# EAGLE board ME461_F28027 (EAGLE 7.7.0), part 1 of 2
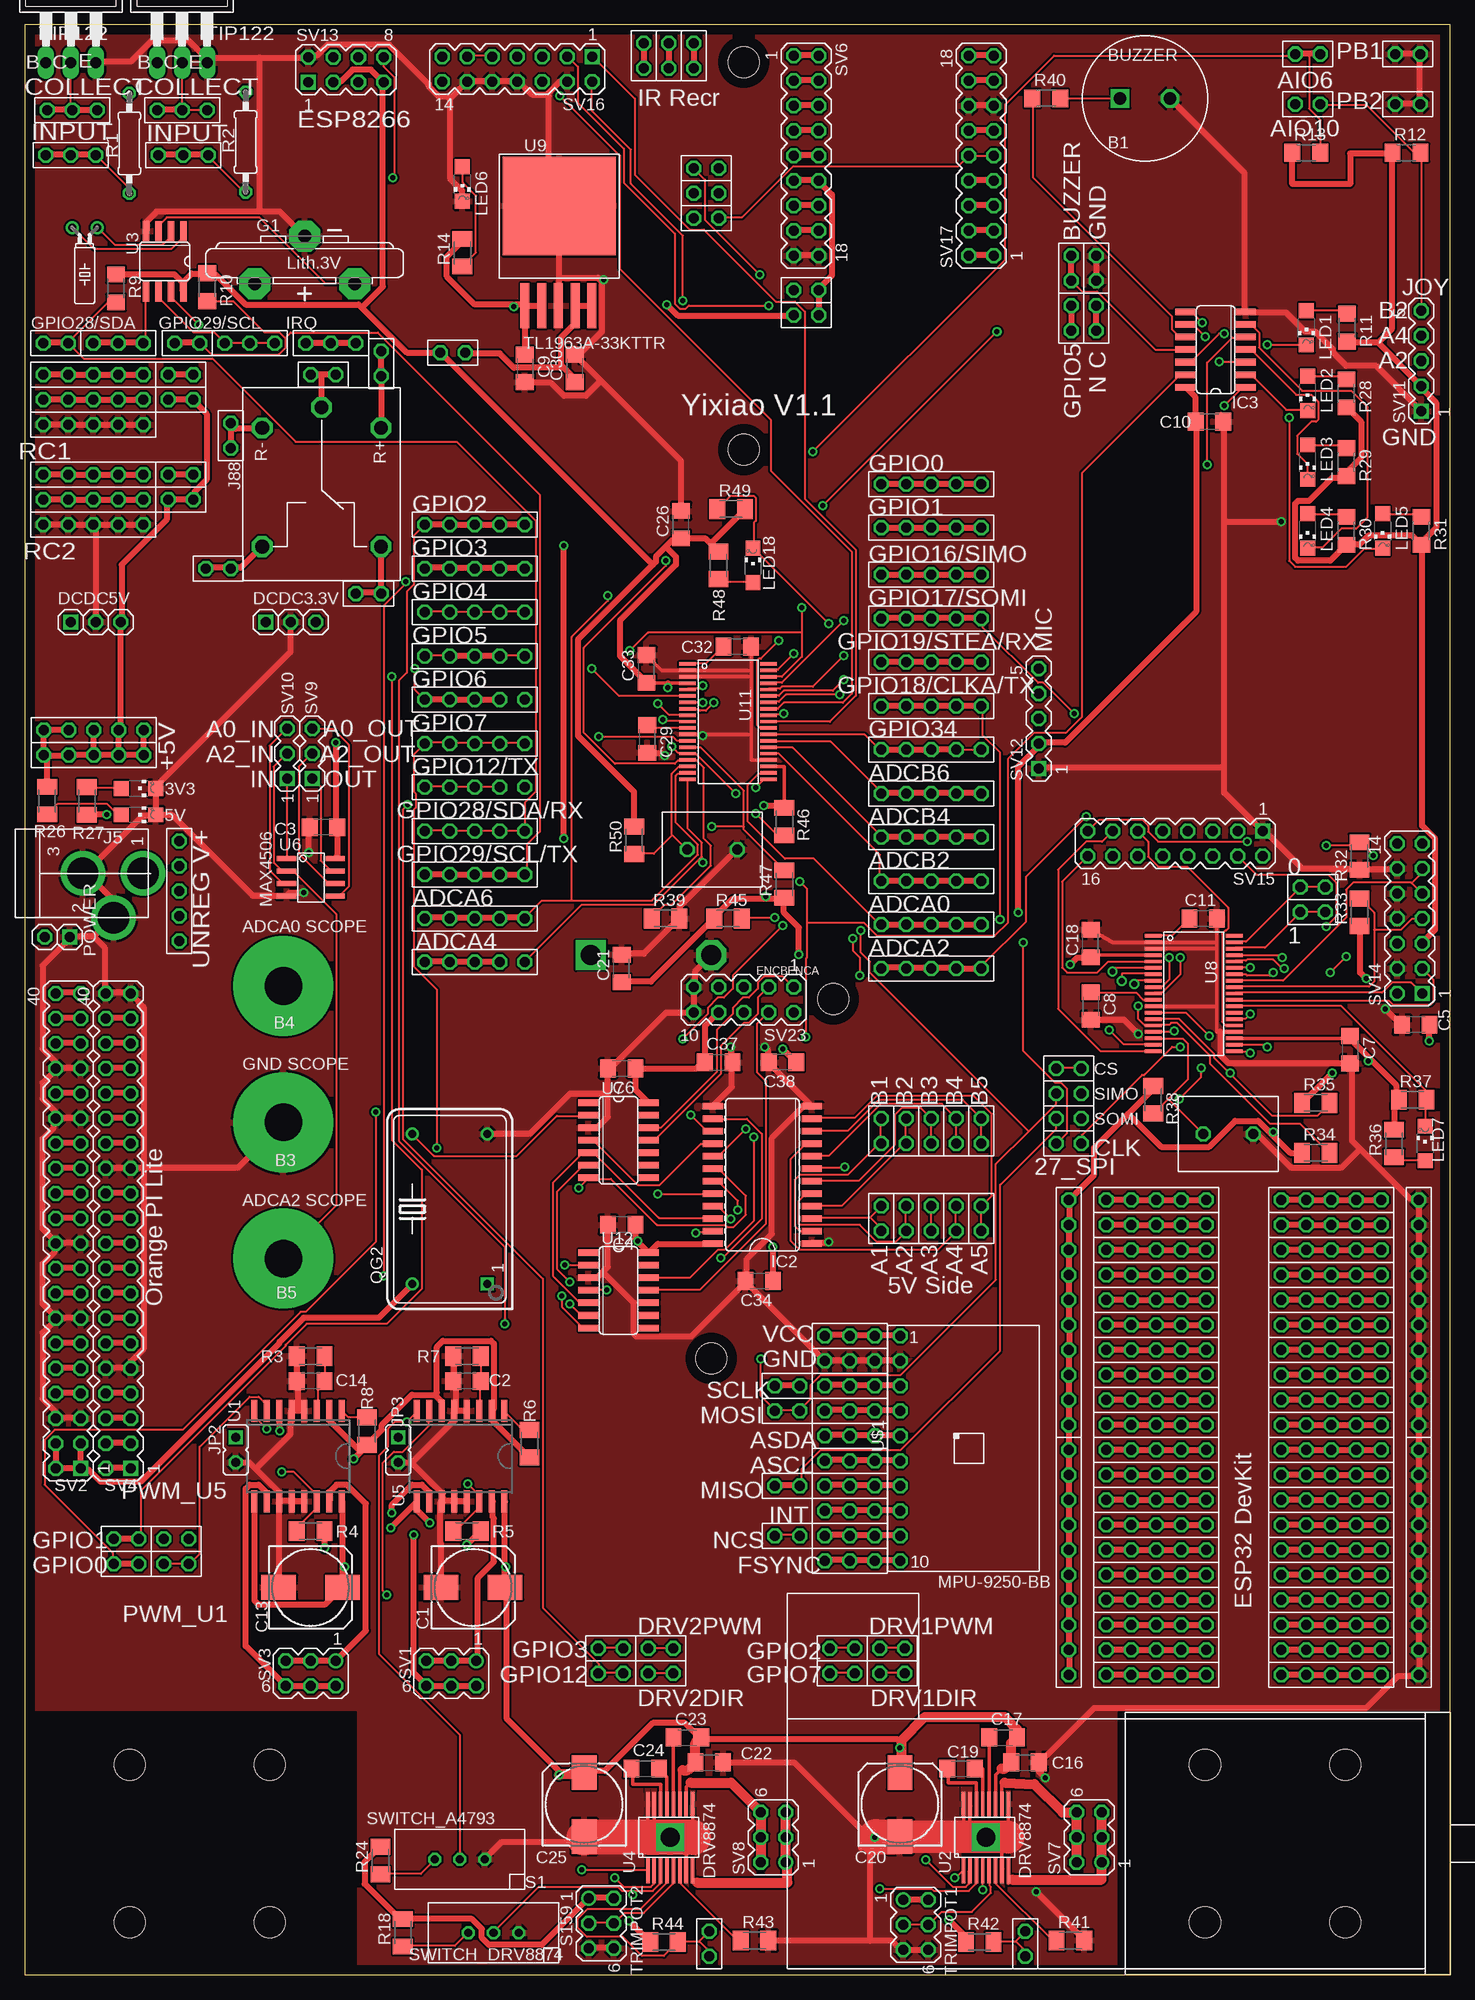
[diagram p5: board, top side]
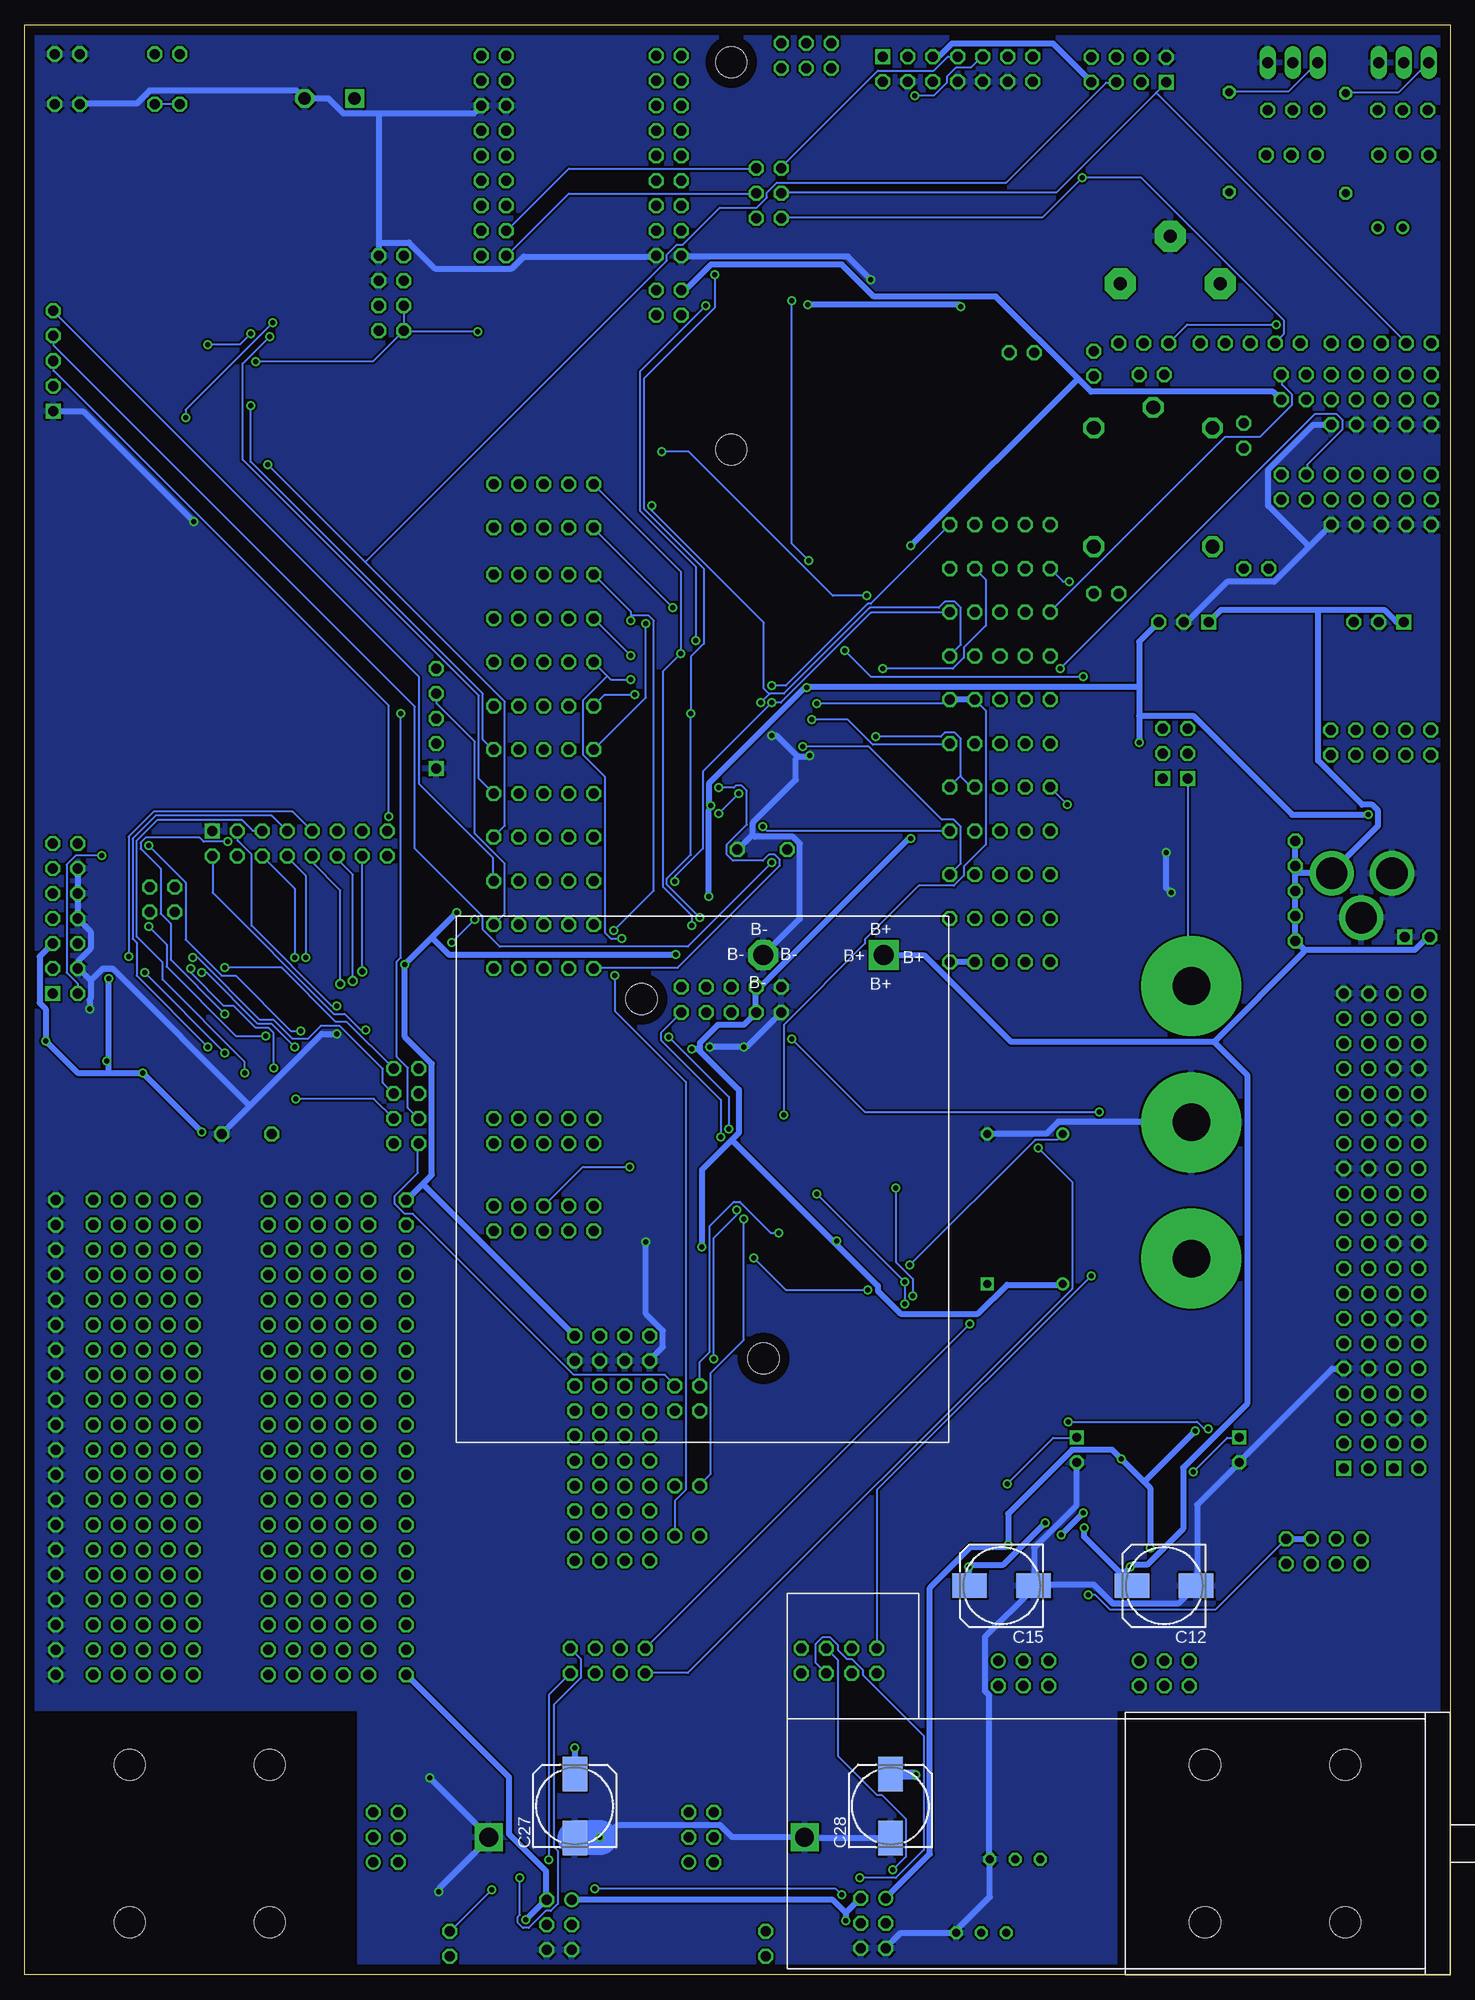
[diagram p6: board, bottom side, seen from below]

Size 144.78 x 198.12 mm. Coordinates in mm from the lower left corner, seen from the top.
Outline: 0,0 144.78,0 144.78,198.12 0,198.12 0,0
Copper layers (1*16): Top 0.035mm / dielectric 1.5mm / Bottom 0.035mm
Design rules "default *": minimum track width 8mil, minimum drill 20mil, track to track 8mil, track to pad 8mil, pad to pad 8mil, via to via 8mil, smd to smd 8mil, copper to edge 40mil, drill to drill 8mil, minimum pad ring 10mil, minimum via ring 8mil, stop-mask expansion 4mil, vias tented up to drill 20mil, thermal gap 10mil
Net classes: 0 default: width 0.203 mm, drill 0.508 mm, clearance 0.203 mm; 1 supply: width 0.61 mm, drill 0.508 mm, clearance 0.203 mm
tRestrict: area 0,0 to 33.7,26.7; area 111.1,0 to 144.8,26.7
bRestrict: area 111.1,0 to 144.8,26.7; area 0,0 to 33.7,26.7

## Footprints (pad centres in the part's own frame; a part is rotated, then mirrored left to right if it is on the bottom)
CHIPLED_1206 = smd 1.5 x 1.5: A 0,-1.75; C 0,1.75
BUZZER = drill 1.27 square: P$1 -2.54,0 | drill 1.27 octagon: P$2 2.54,0
BATTERY_4AA_HOLDER = drill 2.032 square: P$1 0,0 | drill 2.032 octagon: P$2 12.224,0 | hole 3.175: 12.224,40.958; 24.606,4.445
BANANA_MALE = drill 3.81 pad 10.16: P$1 0,0
153CLV-0810 = smd 3.5 x 2.5: + 3.25,0; - -3.25,0
C1206 = smd 1.6 x 1.8: 1 -1.4,0; 2 1.4,0
1X03 = drill 1.016 square: 1 -2.54,0 | drill 1.016 octagon: 2 0,0; 3 2.54,0
CR2032V = drill 1.321 pad 3.15 octagon: + -2.54,-5.08; +@1 -2.54,5.08; - 2.286,0
SO24W = smd 0.66 x 2.032: 1 -6.985,-5.029; 2 -5.715,-5.029; 3 -4.445,-5.029; 4 -3.175,-5.029; 5 -1.905,-5.029; 6 -0.635,-5.029; 7 0.635,-5.029; 8 1.905,-5.029; 9 3.175,-5.029; 10 4.445,-5.029; 11 5.715,-5.029; 12 6.985,-5.029; 13 6.985,5.029; 14 5.715,5.029; 15 4.445,5.029; 16 3.175,5.029; 17 1.905,5.029; 18 0.635,5.029; 19 -0.635,5.029; 20 -1.905,5.029; 21 -3.175,5.029; 22 -4.445,5.029; 23 -5.715,5.029; 24 -6.985,5.029
SO14 = smd 0.66 x 2.032: 1 -3.81,-3.073; 2 -2.54,-3.073; 3 -1.27,-3.073; 4 0,-3.073; 5 1.27,-3.073; 6 2.54,-3.073; 7 3.81,-3.073; 8 3.81,3.073; 9 2.54,3.073; 10 1.27,3.073; 11 0,3.073; 12 -1.27,3.073; 13 -2.54,3.073; 14 -3.81,3.073
STRIP3 = drill 1.016 octagon: P$1 0,0; P$2 2.54,0; P$3 5.08,0
JACK-PMS = drill 3.175 pad 4.5: 1 -0.5,-3.31; 2 -5,-0.31; 3 -0.5,2.809
STRIP2 = drill 1.016 octagon: P$1 0,0; P$2 2.54,0
RELAY_JQC-3F_5V = drill 1.397 octagon: P$1 0,0; P$2 2.064,6.032; P$3 14.129,6.032; P$4 14.129,-6.032; P$5 2.064,-6.032
JP1 = drill 0.914 square: 1 0,-1.27 | drill 0.914 octagon: 2 0,1.27
TH_PUSHBUTTON = drill 1.016 octagon: 1 0,2.54; 2 0,-2.54
1X02 = drill 1.016 square: 1 -1.27,0 | drill 1.016 octagon: 2 1.27,0
TC26H = drill 0.813: 1 -1.27,0; 2 1.27,0
DIL14S = drill 0.813 square: 1 -7.62,-3.81 | drill 0.813: 7 7.62,-3.81; 8 7.62,3.81; 14 -7.62,3.81
0207/10 = drill 0.813 octagon: 1 -5.08,0; 2 5.08,0
M1206 = smd 1.6 x 2: 1 -1.4,0; 2 1.4,0
R1206 = smd 1.6 x 1.803: 1 -1.422,0; 2 1.422,0
SWITCH_SLIDE = drill 0.813 octagon: P$1 0,-5.08; P$2 0,-2.54; P$3 0,0
STRIP5 = drill 1.016 octagon: P$1 0,0; P$2 2.54,0; P$3 5.08,0; P$4 7.62,0; P$5 10.16,0
STRIP10 = drill 1.016 octagon: P$1 0,0; P$2 2.54,0; P$3 5.08,0; P$4 7.62,0; P$5 10.16,0; P$6 12.7,0; P$7 15.24,0; P$8 17.78,0; P$9 20.32,0; P$10 22.86,0
MA03-2 = drill 1.016: 1 -2.54,-1.27 | drill 1.016 octagon: 2 -2.54,1.27; 3 0,-1.27; 4 0,1.27; 5 2.54,-1.27; 6 2.54,1.27
MA20-2 = drill 1.016 square: 1 -24.13,-1.27 | drill 1.016 octagon: 2 -24.13,1.27; 3 -21.59,-1.27; 4 -21.59,1.27; 5 -19.05,-1.27; 6 -19.05,1.27; 7 -16.51,-1.27; 8 -16.51,1.27; 9 -13.97,-1.27; 10 -13.97,1.27; 11 -11.43,-1.27; 12 -11.43,1.27; 13 -8.89,-1.27; 14 -8.89,1.27; 15 -6.35,-1.27; 16 -6.35,1.27; 17 -3.81,-1.27; 18 -3.81,1.27; 19 -1.27,-1.27; 20 -1.27,1.27; 21 1.27,-1.27; 22 1.27,1.27; 23 3.81,-1.27; 24 3.81,1.27; 25 6.35,-1.27; 26 6.35,1.27; 27 8.89,-1.27; 28 8.89,1.27; 29 11.43,-1.27; 30 11.43,1.27; 31 13.97,-1.27; 32 13.97,1.27; 33 16.51,-1.27; 34 16.51,1.27; 35 19.05,-1.27; 36 19.05,1.27; 37 21.59,-1.27; 38 21.59,1.27; 39 24.13,-1.27; 40 24.13,1.27
MA09-2 = drill 1.016 octagon: 1 -10.16,-1.27; 2 -10.16,1.27; 3 -7.62,-1.27; 4 -7.62,1.27; 5 -5.08,-1.27; 6 -5.08,1.27; 7 -2.54,-1.27; 8 -2.54,1.27; 9 0,-1.27; 10 0,1.27; 11 2.54,-1.27; 12 2.54,1.27; 13 5.08,-1.27; 14 5.08,1.27; 15 7.62,-1.27; 16 7.62,1.27; 17 10.16,-1.27; 18 10.16,1.27
MA03-1 = drill 1.016 square: 1 -2.54,0 | drill 1.016 octagon: 2 0,0; 3 2.54,0
MA05-1 = drill 1.016 square: 1 -5.08,0 | drill 1.016 octagon: 2 -2.54,0; 3 0,0; 4 2.54,0; 5 5.08,0
MA04-2 = drill 1.016 square: 1 -3.81,-1.27 | drill 1.016 octagon: 2 -3.81,1.27; 3 -1.27,-1.27; 4 -1.27,1.27; 5 1.27,-1.27; 6 1.27,1.27; 7 3.81,-1.27; 8 3.81,1.27
MA07-2 = drill 1.016 square: 1 -7.62,-1.27 | drill 1.016 octagon: 2 -7.62,1.27; 3 -5.08,-1.27; 4 -5.08,1.27; 5 -2.54,-1.27; 6 -2.54,1.27; 7 0,-1.27; 8 0,1.27; 9 2.54,-1.27; 10 2.54,1.27; 11 5.08,-1.27; 12 5.08,1.27; 13 7.62,-1.27; 14 7.62,1.27
MA08-2 = drill 1.016 square: 1 -8.89,-1.27 | drill 1.016 octagon: 2 -8.89,1.27; 3 -6.35,-1.27; 4 -6.35,1.27; 5 -3.81,-1.27; 6 -3.81,1.27; 7 -1.27,-1.27; 8 -1.27,1.27; 9 1.27,-1.27; 10 1.27,1.27; 11 3.81,-1.27; 12 3.81,1.27; 13 6.35,-1.27; 14 6.35,1.27; 15 8.89,-1.27; 16 8.89,1.27
MA05-2 = drill 1.016 octagon: 1 -5.08,-1.27; 2 -5.08,1.27; 3 -2.54,-1.27; 4 -2.54,1.27; 5 0,-1.27; 6 0,1.27; 7 2.54,-1.27; 8 2.54,1.27; 9 5.08,-1.27; 10 5.08,1.27
TO220 = drill 1.118 long: 1 -2.54,-6.35; 2 0,-6.35; 3 2.54,-6.35
SO16W = smd 0.6 x 2.2: 1 -4.445,-4.6; 2 -3.175,-4.6; 3 -1.905,-4.6; 4 -0.635,-4.6; 5 0.635,-4.6; 6 1.905,-4.6; 7 3.175,-4.6; 8 4.445,-4.6; 9 4.445,4.6; 10 3.175,4.6; 11 1.905,4.6; 12 0.635,4.6; 13 -0.635,4.6; 14 -1.905,4.6; 15 -3.175,4.6; 16 -4.445,4.6
HTSSOP16 = smd 2.5 x 0.35: P$1 -3.4,2.275; P$2 -3.4,1.625; P$3 -3.4,0.975; P$4 -3.4,0.325; P$5 -3.4,-0.325; P$6 -3.4,-0.975; P$7 -3.4,-1.625; P$8 -3.4,-2.275; P$9 3.4,-2.275; P$10 3.4,-1.625; P$11 3.4,-0.975; P$12 3.4,-0.325; P$13 3.4,0.325; P$14 3.4,0.975; P$15 3.4,1.625; P$16 3.4,2.275 | drill 1.905 pad 2.54 square: P$17 0,0
SO08 = smd 0.66 x 2.032: 1 -1.905,-3.073; 2 -0.635,-3.073; 3 0.635,-3.073; 4 1.905,-3.073; 5 1.905,3.073; 6 0.635,3.073; 7 -0.635,3.073; 8 -1.905,3.073
SOIC-8 = smd 1.98 x 0.53: P$1 -2.465,1.905; P$2 -2.465,0.635; P$3 -2.465,-0.635; P$4 -2.465,-1.905; P$5 2.465,-1.905; P$6 2.465,-0.635; P$7 2.465,0.635; P$8 2.465,1.905
DA38 = smd 0.35 x 1.705: 1 -5.85,-4.12; 2 -5.2,-4.12; 3 -4.55,-4.12; 4 -3.9,-4.12; 5 -3.25,-4.12; 6 -2.6,-4.12; 7 -1.95,-4.12; 8 -1.3,-4.12; 9 -0.65,-4.12; 10 0,-4.12; 11 0.65,-4.12; 12 1.3,-4.12; 13 1.95,-4.12; 14 2.6,-4.12; 15 3.25,-4.12; 16 3.9,-4.12; 17 4.55,-4.12; 18 5.2,-4.12; 19 5.85,-4.12; 20 5.85,4.12; 21 5.2,4.12; 22 4.55,4.12; 23 3.9,4.12; 24 3.25,4.12; 25 2.6,4.12; 26 1.95,4.12; 27 1.3,4.12; 28 0.65,4.12; 29 0,4.12; 30 -0.65,4.12; 31 -1.3,4.12; 32 -1.95,4.12; 33 -2.6,4.12; 34 -3.25,4.12; 35 -3.9,4.12; 36 -4.55,4.12; 37 -5.2,4.12; 38 -5.85,4.12
TL1963AKTTR = smd 0.914 x 4.572: P$1 -3.81,-10.16; P$2 -2.108,-10.16; P$3 -0.406,-10.16; P$4 1.295,-10.16; P$5 2.997,-10.16 | smd 11.5 x 10: P$6 -0.3,0
MPU-9250-BB = drill 1.016 octagon: 1 -11.434,-6.96; 2 -8.894,-6.96; 3 -6.354,-6.96; 4 -3.814,-6.96; 5 -1.274,-6.96; 6 1.266,-6.96; 7 3.806,-6.96; 8 6.346,-6.96; 9 8.886,-6.96; 10 11.426,-6.96
GEARMOTOR_MOUNT = hole 3.175: 7.112,8.001; -7.112,8.001; -7.112,-8.001; 7.112,-8.001
CASTERWHEEL = hole 3.175: 19.685,0; -19.685,0

## Placement (x,y rotation side)
3V3  [CHIPLED_1206]  11.56,120.52 270 top
5V  [CHIPLED_1206]  11.56,117.86 270 top
B1  BUZZER  [BUZZER]  113.79,190.63 0 top
B2  BATTERY_4AA_HOLDER  [BATTERY_4AA_HOLDER]  57.52,103.58 180 bottom
B3  GND SCOPE  [BANANA_MALE]  26.29,86.61 0 top
B4  ADCA0 SCOPE  [BANANA_MALE]  26.29,100.46 0 top
B5  ADCA2 SCOPE  [BANANA_MALE]  26.29,72.77 0 top
C1  47uF  [153CLV-0810]  45.56,39.36 0 top
C2  680pF  [C1206]  44.92,60.32 180 top
C3  0.1uf  [C1206]  30.35,116.59 180 top
C4  0.1uF  [C1206]  60.64,76.2 180 top
C5  0.1 uF  [C1206]  141.29,96.52 180 top
C6  0.1uF  [C1206]  60.64,92.08 180 top
C7  2.2 uF  [C1206]  134.62,93.98 270 top
C8  2.2 uF  [C1206]  108.27,98.42 270 top
C9  10 uF  [C1206]  50.8,163.19 270 top
C10  0.1uf  [C1206]  120.33,157.8 0 top
C11  2.2 uF  [C1206]  119.7,107.31 0 top
C12  47uF  [153CLV-0810]  29.05,39.53 180 bottom
C13  47uF  [153CLV-0810]  29.05,39.36 0 top
C14  680pF  [C1206]  29.05,60.32 180 top
C15  47uF  [153CLV-0810]  45.56,39.53 180 bottom
C16  0.1uF  [C1206]  101.6,21.59 0 top
C17  0.1uF  [C1206]  99.38,24.13 0 top
C18  2.2 uF  [C1206]  108.27,104.78 90 top
C19  22nF  [C1206]  95.09,20.95 0 top
C20  47uF  [153CLV-0810]  88.9,17.3 90 top
C21  0.1 uF  [C1206]  60.64,102.23 90 top
C22  0.1uF  [C1206]  69.53,21.59 0 top
C23  0.1uF  [C1206]  67.31,24.13 0 top
C24  22nF  [C1206]  63.02,20.95 0 top
C25  47uF  [153CLV-0810]  56.83,17.3 90 top
C26  2.2 uF  [C1206]  66.67,147.32 90 top
C27  47uF  [153CLV-0810]  88.9,17.14 90 bottom
C28  47uF  [153CLV-0810]  56.83,17.14 90 bottom
C29  2.2 uF  [C1206]  63.23,125.55 270 top
C30  10 uF  [C1206]  55.88,163.19 90 top
C32  2.2 uF  [C1206]  72.38,134.94 0 top
C33  2.2 uF  [C1206]  63.16,132.66 90 top
C34  0.1uF  [C1206]  74.61,70.48 180 top
C37  0.1uF  [C1206]  70.48,92.71 0 top
C38  0.1uF  [C1206]  76.96,92.71 180 top
DCDC3.3V  [1X03]  27.05,137.41 0 top
DCDC5V  [1X03]  7.24,137.41 0 top
G1  CR2032V  [CR2032V]  28.44,174.33 90 top
IC2  743384DW  [SO24W]  74.93,81.28 90 top
IC3  7404D  [SO14]  120.97,165.1 90 top
J1  STRIP3  [STRIP3]  28.57,165.74 0 top
J2  STRIP3  [STRIP3]  20.32,165.74 0 top
J3  STRIP3  [STRIP3]  6.99,165.74 0 top
J4  STRIP3  [STRIP3]  2.28,189.45 0 top
J5  [JACK-PMS]  8.72,112.4 90 top
J6  STRIP3  [STRIP3]  2.15,184.87 0 top
J7  STRIP2  [STRIP2]  108.84,172.09 90 top
J8  STRIP2  [STRIP2]  108.84,167 90 top
J9  STRIP2  [STRIP2]  97.16,87 270 top
J10  STRIP2  [STRIP2]  94.61,87 270 top
J11  STRIP2  [STRIP2]  92.08,87 270 top
J12  STRIP2  [STRIP2]  62.87,193.68 90 top
J13  STRIP2  [STRIP2]  65.41,193.68 90 top
J14  STRIP2  [STRIP2]  89.53,87 270 top
J15  STRIP2  [STRIP2]  87,87 270 top
J16  STRIP2  [STRIP2]  97.16,78.11 270 top
J17  STRIP2  [STRIP2]  94.61,78.11 270 top
J18  STRIP2  [STRIP2]  92.08,78.11 270 top
J19  STRIP2  [STRIP2]  89.53,78.11 270 top
J20  STRIP2  [STRIP2]  87,78.11 270 top
J21  STRIP2  [STRIP2]  129.54,110.49 0 top
J22  STRIP2  [STRIP2]  67.94,193.68 90 top
J23  STRIP3  [STRIP3]  13.46,189.45 0 top
J24  STRIP3  [STRIP3]  13.58,184.87 0 top
J25  STRIP2  [STRIP2]  129.54,107.95 0 top
J26  STRIP2  [STRIP2]  106.3,167 90 top
J27  STRIP2  [STRIP2]  42.23,164.78 0 top
J28  STRIP2  [STRIP2]  80.64,168.59 180 top
J29  STRIP2  [STRIP2]  78.11,171.13 0 top
J30  STRIP2  [STRIP2]  70.48,183.51 180 top
J31  STRIP2  [STRIP2]  67.94,178.44 0 top
J32  STRIP2  [STRIP2]  67.94,180.97 0 top
J35  STRIP2  [STRIP2]  107.31,87 180 top
J36  STRIP2  [STRIP2]  107.31,89.53 180 top
J37  STRIP2  [STRIP2]  107.31,92.08 180 top
J38  STRIP2  [STRIP2]  107.31,84.45 180 top
J70  STRIP2  [STRIP2]  141.73,195.14 180 top
J71  STRIP2  [STRIP2]  131.57,195.14 180 top
J72  STRIP2  [STRIP2]  141.73,190.06 180 top
J73  STRIP2  [STRIP2]  131.57,190.06 180 top
J78  STRIP2  [STRIP2]  101.6,4.45 270 top
J79  STRIP2  [STRIP2]  86.84,33.18 0 top
J80  STRIP2  [STRIP2]  86.84,30.64 0 top
J81  STRIP2  [STRIP2]  69.53,4.45 270 top
J82  STRIP2  [STRIP2]  63.34,33.18 0 top
J83  STRIP2  [STRIP2]  63.34,30.64 0 top
J84  STRIP2  [STRIP2]  81.76,33.18 0 top
J85  STRIP2  [STRIP2]  81.76,30.64 0 top
J86  STRIP2  [STRIP2]  58.26,33.18 0 top
J87  STRIP2  [STRIP2]  58.26,30.64 0 top
J88  RELAY_JQC-3F_5V  [RELAY_JQC-3F_5V]  30.16,159.23 270 top
J89  STRIP2  [STRIP2]  36.2,164.94 270 top
J90  STRIP2  [STRIP2]  20.95,157.64 270 top
J91  STRIP2  [STRIP2]  29.05,162.56 0 top
J92  STRIP2  [STRIP2]  33.66,140.34 0 top
J93  STRIP2  [STRIP2]  18.41,142.88 0 top
J123  STRIP3  [STRIP3]  81.28,64.93 0 top
J124  STRIP3  [STRIP3]  81.28,62.39 0 top
J125  STRIP3  [STRIP3]  81.28,59.85 0 top
J126  STRIP3  [STRIP3]  81.28,57.31 0 top
J127  STRIP3  [STRIP3]  81.28,54.77 0 top
J128  STRIP3  [STRIP3]  81.28,52.23 0 top
J129  STRIP3  [STRIP3]  81.28,49.69 0 top
J130  STRIP3  [STRIP3]  81.28,47.15 0 top
J131  STRIP3  [STRIP3]  81.28,44.61 0 top
J132  STRIP3  [STRIP3]  81.28,42.07 0 top
J194  STRIP2  [STRIP2]  106.3,172.09 90 top
J196  STRIP2  [STRIP2]  14.13,41.75 0 top
J197  STRIP2  [STRIP2]  14.13,44.29 0 top
J198  STRIP2  [STRIP2]  9.05,41.75 0 top
J199  STRIP2  [STRIP2]  9.05,44.29 0 top
J200  STRIP2  [STRIP2]  14.61,160.02 0 top
J201  STRIP2  [STRIP2]  14.61,162.56 0 top
J202  STRIP2  [STRIP2]  14.61,152.4 0 top
J203  STRIP2  [STRIP2]  14.61,149.86 0 top
J204  STRIP2  [STRIP2]  76.2,57.31 0 top
J205  STRIP2  [STRIP2]  76.2,49.69 0 top
J206  STRIP2  [STRIP2]  76.2,59.85 0 top
J207  STRIP2  [STRIP2]  76.2,44.61 0 top
J208  STRIP2  [STRIP2]  1.91,165.74 0 top
J209  STRIP2  [STRIP2]  15.24,165.74 0 top
JP2  [JP1]  21.43,53.33 180 top
JP3  [JP1]  37.94,53.33 180 top
LED1  [CHIPLED_1206]  130.18,167.32 180 top
LED2  [CHIPLED_1206]  130.3,160.66 180 top
LED3  [CHIPLED_1206]  130.3,153.67 180 top
LED4  [CHIPLED_1206]  130.3,146.69 180 top
LED5  [CHIPLED_1206]  137.92,146.69 180 top
LED6  [CHIPLED_1206]  44.45,181.93 180 top
LED7  [CHIPLED_1206]  142.24,84.45 0 top
LED18  [CHIPLED_1206]  73.98,143.19 0 top
P1  [TH_PUSHBUTTON]  122.24,85.41 90 top
P2  [TH_PUSHBUTTON]  69.85,114.3 90 top
POWER  [1X02]  3.33,105.42 180 top
Q1  32.768KHz  [TC26H]  6.09,177.51 180 top
QG2  [DIL14S]  43.18,77.79 90 top
R1  R_B  [0207/10]  10.63,186.06 90 top
R2  R_B  [0207/10]  22.44,186.19 90 top
R3  24.9K  [M1206]  29.05,62.86 0 top
R4  2.2K  [M1206]  29.05,45.08 0 top
R5  2.2K  [M1206]  44.92,45.08 0 top
R6  2.2K  [M1206]  51.27,53.97 270 top
R7  24.9K  [M1206]  44.92,62.86 0 top
R8  2.2K  [M1206]  34.76,55.24 270 top
R9  4.7K  [R1206]  9.27,171.32 270 top
R10  4.7K  [R1206]  18.54,171.45 270 top
R11  [R1206]  134.3,167.32 270 top
R12  10k  [R1206]  140.34,185.1 0 top
R13  10k  [R1206]  130.18,185.1 0 top
R14  1K  [M1206]  44.45,174.94 90 top
R18  2.2K  [M1206]  38.41,4.28 90 top
R24  2.2K  [M1206]  36.13,11.62 90 top
R26  1K  [M1206]  2.29,119.29 90 top
R27  1K  [M1206]  6.31,119.26 270 top
R28  [R1206]  134.24,160.66 270 top
R29  [R1206]  134.24,153.67 270 top
R30  [R1206]  134.24,146.69 270 top
R31  [R1206]  141.86,146.69 270 top
R32  4.7K  [M1206]  135.57,113.67 270 top
R33  4.7K  [M1206]  135.57,107.95 90 top
R34  4.7k  [M1206]  131.13,83.5 0 top
R35  4.7k  [M1206]  131.13,88.58 0 top
R36  1K  [M1206]  139.06,84.45 90 top
R37  4.7k  [M1206]  140.97,88.9 180 top
R38  4.7k  [M1206]  114.62,88.9 90 top
R39  4.7K  [M1206]  65.09,107.31 0 top
R40  100  [R1206]  103.76,190.63 0 top
R41  1.8K  [M1206]  106.2,3.49 0 top
R42  10K  [M1206]  97,3.33 0 top
R43  1.8K  [M1206]  74.14,3.49 0 top
R44  10K  [M1206]  64.93,3.33 0 top
R45  4.7K  [M1206]  71.44,107.31 0 top
R46  4.7k  [M1206]  77.15,117.16 270 top
R47  4.7k  [M1206]  77.15,110.81 90 top
R48  1K  [M1206]  70.48,143.19 90 top
R49  4.7k  [M1206]  71.75,148.91 0 top
R50  4.7k  [M1206]  61.91,115.25 90 top
S1  SWITCH_A4793  [SWITCH_SLIDE]  41.66,11.75 90 top
S2  STRIP5  [STRIP5]  40.64,147.32 0 top
S3  STRIP5  [STRIP5]  40.64,142.88 0 top
S4  STRIP5  [STRIP5]  40.64,138.43 0 top
S5  STRIP5  [STRIP5]  40.64,133.99 0 top
S6  STRIP5  [STRIP5]  40.64,129.54 0 top
S7  STRIP5  [STRIP5]  40.64,125.09 0 top
S8  STRIP5  [STRIP5]  40.64,120.65 0 top
S9  STRIP5  [STRIP5]  40.64,116.2 0 top
S10  STRIP5  [STRIP5]  40.64,111.76 0 top
S11  STRIP5  [STRIP5]  40.64,107.31 0 top
S12  STRIP5  [STRIP5]  40.64,102.87 0 top
S13  STRIP5  [STRIP5]  87,151.45 0 top
S14  STRIP5  [STRIP5]  87,147 0 top
S15  STRIP5  [STRIP5]  87,142.24 0 top
S16  STRIP5  [STRIP5]  87,137.79 0 top
S17  STRIP5  [STRIP5]  12.12,123.91 180 top
S18  STRIP5  [STRIP5]  12.12,126.45 180 top
S19  STRIP5  [STRIP5]  87,133.35 0 top
S20  STRIP10  [STRIP10]  141.6,30.48 90 top
S21  STRIP5  [STRIP5]  87,128.91 0 top
S22  STRIP5  [STRIP5]  87,120.02 0 top
S23  STRIP5  [STRIP5]  87,106.68 0 top
S24  STRIP10  [STRIP10]  141.6,55.88 90 top
S25  STRIP5  [STRIP5]  87,115.57 0 top
S26  STRIP5  [STRIP5]  87,124.46 0 top
S27  STRIP5  [STRIP5]  87,111.12 0 top
S28  STRIP5  [STRIP5]  87,102.23 0 top
S53  STRIP10  [STRIP10]  106.05,30.48 90 top
S58  STRIP10  [STRIP10]  106.05,55.88 90 top
S129  STRIP5  [STRIP5]  12.06,157.48 180 top
S130  STRIP5  [STRIP5]  12.06,162.56 180 top
S137  STRIP5  [STRIP5]  12.06,147.32 180 top
S138  STRIP5  [STRIP5]  12.06,152.4 180 top
S139  STRIP5  [STRIP5]  12.06,149.86 180 top
S141  STRIP5  [STRIP5]  15.71,105.03 90 top
S147  STRIP5  [STRIP5]  12.06,160.02 180 top
S159  SWITCH_DRV8874  [SWITCH_SLIDE]  45.08,4.28 90 top
S167  STRIP5  [STRIP5]  109.86,78.74 0 top
S168  STRIP5  [STRIP5]  109.86,76.2 0 top
S169  STRIP5  [STRIP5]  109.86,73.66 0 top
S170  STRIP5  [STRIP5]  109.86,71.12 0 top
S171  STRIP5  [STRIP5]  109.86,68.58 0 top
S172  STRIP5  [STRIP5]  109.86,66.04 0 top
S173  STRIP5  [STRIP5]  109.86,63.5 0 top
S174  STRIP5  [STRIP5]  109.86,60.96 0 top
S175  STRIP5  [STRIP5]  109.86,58.42 0 top
S176  STRIP5  [STRIP5]  109.86,55.88 0 top
S177  STRIP5  [STRIP5]  109.86,53.34 0 top
S178  STRIP5  [STRIP5]  109.86,50.8 0 top
S179  STRIP5  [STRIP5]  109.86,48.26 0 top
S180  STRIP5  [STRIP5]  109.86,45.72 0 top
S181  STRIP5  [STRIP5]  109.86,43.18 0 top
S182  STRIP5  [STRIP5]  109.86,40.64 0 top
S183  STRIP5  [STRIP5]  109.86,38.1 0 top
S184  STRIP5  [STRIP5]  109.86,35.56 0 top
S185  STRIP5  [STRIP5]  109.86,33.02 0 top
S186  STRIP5  [STRIP5]  109.86,30.48 0 top
S187  STRIP5  [STRIP5]  127.64,30.48 0 top
S188  STRIP5  [STRIP5]  127.64,35.56 0 top
S189  STRIP5  [STRIP5]  127.64,33.02 0 top
S210  STRIP5  [STRIP5]  127.64,78.74 0 top
S211  STRIP5  [STRIP5]  127.64,76.2 0 top
S212  STRIP5  [STRIP5]  127.64,73.66 0 top
S213  STRIP5  [STRIP5]  127.64,71.12 0 top
S214  STRIP5  [STRIP5]  127.64,68.58 0 top
S215  STRIP5  [STRIP5]  127.64,66.04 0 top
S216  STRIP5  [STRIP5]  127.64,63.5 0 top
S217  STRIP5  [STRIP5]  127.64,60.96 0 top
S218  STRIP5  [STRIP5]  127.64,58.42 0 top
S219  STRIP5  [STRIP5]  127.64,55.88 0 top
S220  STRIP5  [STRIP5]  127.64,53.34 0 top
S221  STRIP5  [STRIP5]  127.64,50.8 0 top
S222  STRIP5  [STRIP5]  127.64,48.26 0 top
S223  STRIP5  [STRIP5]  127.64,45.72 0 top
S224  STRIP5  [STRIP5]  127.64,43.18 0 top
S225  STRIP5  [STRIP5]  127.64,40.64 0 top
S226  STRIP5  [STRIP5]  127.64,38.1 0 top
SV1  [MA03-2]  43.33,30.63 180 top
SV2  [MA20-2]  4.45,75.56 90 top
SV3  [MA03-2]  29.05,30.63 180 top
SV4  [MA20-2]  9.53,75.56 90 top
SV6  [MA09-2]  79.38,184.78 270 top
SV7  [MA03-2]  108.11,13.97 90 top
SV8  [MA03-2]  76.04,13.97 90 top
SV9  [MA03-1]  29.21,124.08 90 top
SV10  [MA03-1]  26.67,124.08 90 top
SV11  [MA05-1]  141.86,163.96 90 top
SV12  [MA05-1]  103,127.64 90 top
SV13  [MA04-2]  32.64,193.55 0 top
SV14  [MA07-2]  140.65,107.31 90 top
SV15  [MA08-2]  116.84,114.94 180 top
SV16  [MA07-2]  50.01,193.61 180 top
SV17  [MA09-2]  97.16,184.78 90 top
SV23  [MA05-2]  73.03,99.06 180 top
T1  TIP125  [TO220]  4.69,200.62 0 top
T2  TIP125  [TO220]  16,200.62 0 top
TRIMPOT1  [MA03-2]  90.49,5.08 270 top
TRIMPOT2  [MA03-2]  58.58,5.24 270 top
U1  A4973  [SO16W]  27.78,52.7 180 top
U2  DRV8874  [HTSSOP16]  97.63,13.97 90 top
U3  BQ32000  [SO08]  14.22,174.08 180 top
U4  DRV8874  [HTSSOP16]  65.56,13.97 90 top
U5  A4973  [SO16W]  44.29,52.7 180 top
U6  MAX4506  [SOIC-8]  29.08,111.51 0 top
U7  LS7366  [SO14]  60.33,84.77 270 top
U8  F28027  [DA38]  118.75,99.69 270 top
U9  TL1963A-33KTTR  [TL1963AKTTR]  54.61,179.71 0 top
U11  F28027  [DA38]  71.44,127.32 270 top
U12  LS7366  [SO14]  60.33,69.53 270 top
U$1  MPU-9250-BB  [MPU-9250-BB]  95.89,53.5 270 top
U$2  GEARMOTOR_MOUNT  [GEARMOTOR_MOUNT]  127,13.34 0 top
U$3  GEARMOTOR_MOUNT  [GEARMOTOR_MOUNT]  17.78,13.34 0 bottom
U$4  CASTERWHEEL  [CASTERWHEEL]  73.03,174.62 90 top

## Tracks (layer width: path | path; a pad name or v marks a point on that pad's centre or on a via)
5V_FTDI
  Top 0.203: 78.16,182.3 SV6.11 | 80.59,182.3 SV6.12
  Top 0.61: 80.59,182.3 78.16,182.3 | J28.P$1 80.67,168.66 80.67,171.09 J29.P$2 80.77,171.4 81.99,172.62 81.99,180.85 80.77,182.07 SV6.12
28027_1_GPIO0
  Top 0.203: U8.37 122.94,104.95 124.05,104.95 129.54,110.44 J21.P$1 129.54,110.54 132.08,110.54 J21.P$2
28027_1_GPIO1
  Top 0.203: U8.36 122.94,104.34 125.98,104.34 129.54,107.9 J25.P$1 129.54,108 132.08,108 J25.P$2
28027_1_GPIO2
  Top 0.203: U8.5 114.61,102.92 110.03,102.92 108.92,101.8 105.87,101.8 105.36,102.31 105.36,111.05 107.9,113.59 SV15.16
28027_1_GPIO3  (via drill 0.6)
  Top 0.203: U8.6 110.49,102.3 v110.49,101.92
  Bottom 0.203: v110.49,101.92 SV15.14
28027_1_GPIO4  (via drill 0.6)
  Top 0.203: U8.7 114.61,101.7 111.44,101.7 v111.44,100.97
  Bottom 0.203: v111.44,100.97 111.44,111.76 113.03,113.35 SV15.12
28027_1_GPIO5  (via drill 0.6)
  Top 0.203: U8.8 112.71,101 v112.71,100.65
  Bottom 0.203: v112.71,100.65 112.71,110.17 115.57,113.03 SV15.10
28027_1_GPIO6  (via drill 0.51)
  Top 0.203: v116.23,103.33 116.23,101.09 115.52,100.38 114.71,100.38 U8.9
  Bottom 0.203: 118.06,113.59 SV15.8 118.06,113.49 116.23,111.66 v116.23,103.33
28027_1_GPIO7  (via drill 0.51)
  Top 0.203: v117.35,103.33 117.35,101.6 115.52,99.77 114.71,99.77 U8.10
  Bottom 0.203: v117.35,103.33 117.35,110.34 120.6,113.59 SV15.6
28027_1_GPIO12  (via drill 0.51)
  Top 0.203: v120.29,95.4 117.96,97.74 114.71,97.74 U8.13 | v132.18,106.48 133.2,107.49 133.2,110.95 132.38,111.76 125.07,111.76 123.24,113.59 SV15.4
  Bottom 0.203: v120.29,95.4 123.34,95.4 130.35,102.41 130.35,104.65 v132.18,106.48
28027_1_GPIO34
  Top 0.203: LED7.C 142.24,88.8 142.34,88.9 R37.1 142.24,88.9 142.24,89.92 133.71,98.45 122.94,98.45 U8.27
28027_1_SCL  (via drill 0.51)
  Top 0.203: R34.2 132.49,83.52 129.54,86.46 126.49,86.46 120.4,92.56 120.4,93.37 117.04,96.72 116.43,96.72 116.23,96.52 114.71,96.52 U8.15 114.61,96.52 113.69,96.52 113.08,97.13 v113.08,98.45
  Bottom 0.203: v113.08,98.45 113.59,98.45 121.72,106.58 121.72,113.79 123.14,115.21 123.14,116.13 SV15.3
28027_1_SDA  (via drill 0.51)
  Top 0.203: 122.38,91.59 126.69,87.27 131.27,87.27 132.49,88.49 R35.2 | 122.38,91.59 120.8,93.17 120.8,93.57 117.25,97.13 114.71,97.13 U8.14 | v122.43,91.64 122.38,91.59
  Bottom 0.203: v122.43,91.64 122.43,92.76 130.76,101.09 130.76,102.82 133.4,105.46 133.4,115.21 131.27,117.35 122.73,117.35 121.61,116.23 120.7,116.23 SV15.5
28027_1_SPICLKA  (via drill 0.51)
  Top 0.203: v126.8,101.8 126.49,101.5 124.16,101.5 124.05,101.6 122.94,101.6 U8.32 | v117.35,94.28 116.53,94.28 113.69,91.44 113.49,91.44 107.39,85.34 107.39,84.53 J38.P$1
  Bottom 0.203: v126.8,101.8 126.29,101.8 121.11,96.62 119.69,96.62 v117.35,94.28
28027_1_SPISIMOA  (via drill 0.51)
  Top 0.203: v127.71,103.33 127.51,103.53 122.94,103.53 U8.35
  Bottom 0.203: v127.71,103.33 127.2,103.33 120.9,97.03 119.48,97.03 117.55,95.1 116.03,95.1 114.71,96.42 112.78,96.42 108.41,92.05 108.41,90.63 J36.P$1
28027_1_SPISOMIA  (via drill 0.51)
  Top 0.203: v127.91,102.21 127.71,102.21 126.8,103.12 124.16,103.12 124.05,103.02 122.94,103.02 U8.34 | v119.48,92.15 119.48,91.24 v117.25,89
  Bottom 0.203: v127.91,102.21 127.91,101.8 124.56,98.45 123.55,98.45 121.31,96.22 119.99,96.22 119.48,95.71 v119.48,92.15 | v117.25,89 109.32,89 J35.P$1
28027_1_SPISTEA  (via drill 0.51)
  Top 0.203: v124.46,102.31 122.94,102.31 U8.33 | J37.P$2 104.85,92.15 107.29,92.15 J37.P$1
  Bottom 0.203: v124.46,102.31 118.67,102.31 113.18,96.83 112.06,96.83 J37.P$1
28027_2_GPIO0  (via drill 0.51)
  Top 0.203: 9.14,41.76 J198.P$1 8.94,41.96 8.94,42.88 2.03,49.78 2.03,54.36 3.05,55.37 16.05,55.37 28.04,67.36 28.55,67.36 35.66,74.47 v35.66,87.68 | J198.P$2 | 89.51,151.49 S13.P$2 89.61,151.49 | 87.07,151.49 S13.P$1 | 92.05,151.49 S13.P$3 92.15,151.49 | 94.59,151.49 S13.P$4 94.69,151.49 | 97.13,151.49 S13.P$5 | v78.13,134.21 76.5,132.59 75.59,132.59 U11.37 | v66.85,95.1 69.39,97.64 69.39,98.25 70.41,99.26 71.02,99.26 71.93,100.18 71.93,101.5 v77.01,106.58
  Top 0.61: J198.P$2 9.14,41.76 | 87.07,151.49 89.51,151.49 | 89.61,151.49 92.05,151.49 | 92.15,151.49 94.59,151.49 | 94.69,151.49 97.13,151.49
  Bottom 0.203: S13.P$1 86.97,151.38 78.13,142.54 v78.13,134.21 79.96,132.38 79.96,110.54 77.01,107.59 v77.01,106.58 | v35.66,87.68 59.44,87.68 v66.85,95.1
28027_2_GPIO1  (via drill 0.51)
  Top 0.203: 9.14,44.3 J199.P$1 | J199.P$2 11.79,44.5 11.79,49.17 26.52,63.91 26.52,64.01 28.65,66.14 36.78,66.14 40.34,69.7 40.34,81.79 37.29,84.84 v37.29,131.88 | 89.51,147.01 S14.P$2 89.61,147.01 | 87.07,147.01 S14.P$1 | 92.05,147.01 S14.P$3 92.15,147.01 | 94.59,147.01 S14.P$4 94.69,147.01 | 97.13,147.01 S14.P$5 | v78.94,138.89 78.94,136.35 | 78.94,136.35 78.94,133.91 76.91,131.88 75.59,131.88 U11.36 | v61.47,134.52 63.3,136.35 78.94,136.35
  Top 0.61: J199.P$2 9.14,44.3 | 87.07,147.01 89.51,147.01 | 89.61,147.01 92.05,147.01 | 92.15,147.01 94.59,147.01 | 94.69,147.01 97.13,147.01
  Bottom 0.203: v78.94,138.89 86.97,146.91 S14.P$1 | v37.29,131.88 58.83,131.88 v61.47,134.52
28027_2_GPIO2  (via drill 0.51)
  Top 0.203: J84.P$1 81.79,33.22 84.23,33.22 J84.P$2 | v68.89,130.96 68.58,130.66 67.36,130.66 U11.5 | v48.77,66.14 48.77,73.97 38,84.73 38,131.47 38.81,132.28 38.81,140.51 39.52,141.22 39.52,146.2 S2.P$1
  Top 0.61: S2.P$1 S2.P$2 S2.P$3 S2.P$4 S2.P$5
  Bottom 0.203: v68.89,130.96 67.46,130.96 59.13,139.29 58.83,139.29 S2.P$5 | v48.77,66.14 81.69,33.22 J84.P$1
28027_2_GPIO3  (via drill 0.51)
  Top 0.203: J86.P$1 58.32,33.22 60.76,33.22 J86.P$2 | 40.64,142.95 S3.P$1 | 43.18,142.95 S3.P$2 | 45.72,142.95 S3.P$3 | 50.8,142.95 S3.P$5 | 48.26,142.95 S3.P$4 | v57.61,132.69 60.35,129.95 67.26,129.95 U11.6 | v36.47,71.02 36.47,139.09 38.71,141.33 v38.71,141.53
  Top 0.61: 40.64,142.95 43.18,142.95 45.72,142.95 48.26,142.95 50.8,142.95
  Bottom 0.203: v57.61,132.69 50.49,132.69 49.38,133.81 49.38,134.82 47.14,137.06 47.14,141.73 48.26,142.85 S3.P$4 | v36.47,71.02 58.22,49.28 58.22,33.22 J86.P$1 | v38.71,141.53 39.32,141.53 40.64,142.85 S3.P$1
28027_2_GPIO4  (via drill 0.51)
  Top 0.203: 43.18,138.48 40.64,138.48 S4.P$1 | 43.18,138.48 45.72,138.48 | 43.18,138.48 S4.P$2 | 45.72,138.48 48.26,138.48 | 45.72,138.48 S4.P$3 | v68.89,129.24 67.36,129.24 U11.7 | v73.25,85.95 70.51,83.21 69.9,83.21 IC2.17 | v79.35,95.3 79.35,103.23 79.45,103.33 79.45,106.88 | 79.45,106.88 79.45,110.34 v78.74,111.05 | IC3.13 117.35,162.56 107.39,152.6 107.39,127.81 105.77,126.19 102.51,126.19 99.87,123.55 99.87,106.88 98.55,105.56 86.56,105.56 85.24,106.88 79.45,106.88 | 48.26,138.48 50.8,138.48 S4.P$5 | 48.26,138.48 S4.P$4
  Top 0.61: J201.P$2 J201.P$1
  Bottom 0.203: J201.P$2 17.07,162.56 17.07,161.54 16.05,160.53 16.05,159.51 19.3,156.26 22.86,156.26 40.64,138.48 S4.P$1 | S4.P$5 50.8,138.38 58.83,138.38 67.97,129.24 v68.89,129.24 75.89,122.22 75.89,114.4 78.74,111.56 v78.74,111.05 | v73.25,85.95 73.25,89.2 v79.35,95.3
28027_2_GPIO5  (via drill 0.51)
  Top 0.203: S5.P$1 40.64,134.01 43.18,134.01 S5.P$2 | 48.26,134.01 S5.P$4 48.46,134.01 50.8,134.01 S5.P$5 | 45.72,134.01 S5.P$3 | v121.31,163.88 123.95,163.88 IC3.3 | v70,129.24 69.19,128.42 68.58,128.42 68.48,128.52 67.36,128.52 U11.8 | v81.08,149.25 v98.75,166.93
  Top 0.61: 43.18,134.01 45.72,134.01 48.26,134.01
  Bottom 0.203: J26.P$1 106.27,167.03 106.27,169.47 J26.P$2 | v121.31,163.88 109.42,163.88 J26.P$1 | 69.14,130.1 69.09,130.15 67.67,130.15 58.93,138.89 51.92,138.89 51.31,139.5 50.29,139.5 49.68,138.89 49.68,135.13 50.8,134.01 S5.P$5 | 69.14,130.1 v70,129.24 | v98.75,166.93 106.27,166.93 J26.P$1 | v81.08,149.25 81.08,148.74 69.7,137.36 69.7,130.66 69.14,130.1
28027_2_GPIO6  (via drill 0.51)
  Top 0.203: v64.31,129.13 65.43,128.02 67.26,128.02 U11.9 | v67.67,87.38 69.29,85.75 69.9,85.75 IC2.15 | v39.62,132.69 39.62,130.56 S6.P$1
  Top 0.61: J202.P$2 J202.P$1 | S6.P$1 S6.P$2 S6.P$3 S6.P$4
  Bottom 0.203: v64.31,129.13 51.21,129.13 S6.P$5 | v67.67,87.38 67.67,96.52 59.44,104.75 59.44,105.16 53.95,110.64 50.39,110.64 49.38,111.66 49.38,112.57 47.14,114.81 47.14,128.42 S6.P$4 | v39.62,132.69 13.72,158.6 11.58,158.6 10.97,157.99 10.97,156.97 14.53,153.42 14.53,152.4 J202.P$1
  Bottom 0.61: S6.P$4 S6.P$5
28027_2_GPIO7  (via drill 0.51)
  Top 0.203: J85.P$1 81.79,30.68 84.23,30.68 J85.P$2 | v64.82,127.51 64.92,127.41 67.26,127.41 U11.10 | 43.18,125.17 40.64,125.17 S7.P$1 40.64,125.07 39.52,123.95 39.52,120.19 39.73,119.99 39.73,118.57 39.52,118.36 39.52,102.41 41.86,100.08 v41.86,84.02 | 43.18,125.17 45.72,125.17 | 43.18,125.17 S7.P$2 | 45.72,125.17 48.26,125.17 | 45.72,125.17 S7.P$3 | 48.26,125.17 50.8,125.17 S7.P$5 | 48.26,125.17 S7.P$4
  Bottom 0.203: v64.82,127.51 61.16,127.51 58.62,124.97 50.9,124.97 50.8,125.07 S7.P$5 | v41.86,84.02 38.41,80.57 38.41,69.7 77.42,30.68 81.69,30.68 J85.P$1
28027_2_GPIO12  (via drill 0.51)
  Top 0.203: 58.32,30.68 J87.P$1 | v58.32,125.78 65.84,125.78 66.24,125.37 67.26,125.37 U11.13 | J87.P$1 58.42,30.68 60.76,30.68 J87.P$2 | 43.18,120.7 40.64,120.7 S8.P$1 | 43.18,120.7 45.72,120.7 | 43.18,120.7 S8.P$2 | v38.91,118.87 38.41,118.36 38.41,84.94 52.63,70.71 52.63,37.29 58.32,31.6 58.32,30.79 J87.P$1 | 45.72,120.7 48.26,120.7 S8.P$4 | 45.72,120.7 S8.P$3
  Bottom 0.203: v58.32,125.78 51.71,125.78 51.31,126.19 50.29,126.19 49.68,125.58 49.68,121.82 49.73,121.77 | 49.73,121.77 50.8,120.7 S8.P$5 | 49.73,121.77 48.67,120.7 48.26,120.7 S8.P$4 | v38.91,118.87 40.64,120.6 S8.P$1
28027_2_GPIO34  (via drill 0.51)
  Top 0.203: S26.P$4 S26.P$5 | R49.1 70.41,148.95 71.73,150.27 74.07,150.27 74.27,150.06 74.27,147.73 74.07,147.52 74.07,144.98 LED18.C 74.07,144.88 v81.69,137.26 | U11.27 75.59,125.98 85.34,125.98 86.77,124.56 S26.P$1 | v121.82,159.41 123.65,161.24 123.95,161.24 IC3.1
  Top 0.61: S26.P$1 S26.P$2 S26.P$3 S26.P$4
  Bottom 0.203: v121.82,159.41 121.82,153.72 98.25,130.15 98.25,125.48 97.23,124.46 S26.P$5 | v81.69,137.26 81.69,129.74 86.97,124.46 S26.P$1
28027_2_SCL  (via drill 0.51)
  Top 0.203: 15.24,165.81 J209.P$1 | 17.78,165.81 J209.P$2 17.98,165.61 19,164.59 25.81,164.59 26.52,165.3 26.52,166.22 26.47,166.27 | v65.73,124.77 66.34,124.16 67.26,124.16 U11.15 67.36,124.05 68.17,124.05 v72.24,119.99 | v74.27,117.96 76.4,115.82 77.11,115.82 R46.2 | 26.47,166.27 25.91,166.83 24.38,166.83 21.23,169.98 18.59,169.98 R10.2 | v37.39,182.57 37.59,182.78 37.59,192.74 36.47,193.85 36.47,194.77 SV13.8 | 26.47,166.27 27.03,166.83 35.87,166.83 52.32,150.37 52.32,116.13 51,114.81 51,111.96 S10.P$5
  Top 0.61: 17.78,165.81 15.24,165.81 | S10.P$1 S10.P$2 S10.P$3 S10.P$4 S10.P$5
  Bottom 0.203: v65.73,124.77 59.03,124.77 51.61,117.35 50.39,117.35 49.68,116.64 49.68,112.88 S10.P$5 | v72.24,119.99 v74.27,117.96 | J209.P$2 17.78,165.81 16.87,166.73 16.87,168.05 31.39,182.57 v37.39,182.57 41.45,178.51 67.87,178.51 J31.P$1
28027_2_SDA  (via drill 0.51)
  Top 0.203: 1.93,165.81 J208.P$1 | 4.37,165.81 J208.P$2 | 43.18,116.23 40.64,116.23 S9.P$1 | 43.18,116.23 45.72,116.23 | 43.18,116.23 S9.P$2 | 45.72,116.23 48.26,116.23 | 45.72,116.23 S9.P$3 | 48.26,116.23 50.8,116.23 | 48.26,116.23 S9.P$4 | 73.05,116.64 73.05,116.33 77.11,112.27 R47.2 | 73.05,116.64 73.05,120.29 68.68,124.66 67.36,124.66 U11.14 | 73.05,116.64 v69.8,116.64 | R9.2 9.25,169.88 8.43,169.88 4.57,166.01 J208.P$2 | 50.8,116.23 50.8,119.08 51.92,120.19 51.92,147.73 43.89,155.75 27.53,155.75 19.1,164.19 5.99,164.19 J208.P$2 | 50.8,116.23 S9.P$5
  Top 0.61: 4.37,165.81 1.93,165.81
  Bottom 0.203: v69.8,116.64 69.39,116.23 50.8,116.23 S9.P$5 | 29.87,191.21 28.85,192.23 SV13.1 | 29.87,191.21 40.03,181.05 67.87,181.05 J32.P$1 | 29.87,191.21 4.47,165.81 J208.P$2
28027_2_SPICLKA  (via drill 0.51)
  Top 0.203: 89.51,128.93 S21.P$2 89.61,128.93 | 87.07,128.93 S21.P$1 | 92.05,128.93 S21.P$3 92.15,128.93 | 94.59,128.93 S21.P$4 94.69,128.93 | 97.13,128.93 S21.P$5 97.33,128.73 97.33,125.88 99.06,124.16 v99.06,107.19 | 78.74,59.94 J206.P$2 | 76.2,59.94 J206.P$1 | v82.8,130.05 77.32,130.05 76.61,129.34 75.59,129.34 U11.32 | v68.17,75.39 68.28,75.49 69.9,75.49 IC2.23 | v101.4,104.85 101.4,93.88 104.65,90.63 105.26,90.63 105.87,90.02 105.87,85.55 J38.P$2
  Top 0.61: 87.07,128.93 89.51,128.93 | 89.61,128.93 92.05,128.93 | 92.15,128.93 94.59,128.93 | 94.69,128.93 97.13,128.93 | 76.2,59.94 78.74,59.94
  Bottom 0.203: v82.8,130.05 85.85,130.05 S21.P$1 | v68.17,75.39 68.99,75.39 72.14,78.54 72.75,78.54 75.18,76.1 75.18,63.3 76.2,62.28 J206.P$1 | J38.P$2 104.85,84.43 104.85,81.48 107.19,79.15 107.19,78.33 106.17,77.32 105.36,77.32 89,60.96 79.76,60.96 78.74,59.94 J206.P$2 | v101.4,104.85 v99.06,107.19
28027_2_SPISIMOA  (via drill 0.51)
  Top 0.203: v83.21,137.57 76.91,131.27 75.59,131.27 U11.35 | v72.44,77.72 72.44,78.64 70.51,80.57 69.9,80.57 IC2.19 | v74.78,62.59 74.78,58.83 76.2,57.4 | 76.2,57.4 78.74,57.4 | 76.2,57.4 J204.P$1 | 101.96,85.7 98.65,82.4 98.65,70.61 89,60.96 80.87,60.96 79.86,59.94 79.86,58.52 78.74,57.4 | 101.96,85.7 104.75,88.49 104.75,89.51 J36.P$2 | 78.74,57.4 J204.P$2 | v84.94,106.07 84.94,103.83 85.85,102.92 85.85,101.8 101.96,85.7
  Top 0.61: S15.P$1 S15.P$2 S15.P$3 S15.P$4 S15.P$5
  Bottom 0.203: 83.21,138.07 83.21,138.48 86.97,142.24 S15.P$1 | 83.21,138.07 v83.21,137.57 | v72.44,77.72 72.44,77.22 74.78,74.88 v74.78,62.59 | 83.21,138.07 81.38,138.07 80.87,137.57 80.87,110.13 v84.94,106.07
28027_2_SPISOMIA  (via drill 0.51)
  Top 0.203: 89.51,137.87 S16.P$2 89.61,137.87 | 87.07,137.87 S16.P$1 | 92.05,137.87 S16.P$3 92.15,137.87 | 94.59,137.87 S16.P$4 94.69,137.87 | 97.13,137.87 S16.P$5 97.33,137.67 97.33,136.85 102.92,131.27 103.43,131.27 v106.58,128.12 | 78.74,49.78 J205.P$2 78.94,49.99 78.94,51.41 80.87,53.34 89,53.34 99.06,63.4 99.06,80.26 104.75,85.95 104.75,86.97 J35.P$2 | 76.2,49.78 J205.P$1 | v83.21,134.01 80.06,130.86 76.91,130.86 76.71,130.66 75.59,130.66 U11.34 | v71.73,76.81 70.51,78.03 69.9,78.03 IC2.21
  Top 0.61: 87.07,137.87 89.51,137.87 | 89.61,137.87 92.05,137.87 | 92.15,137.87 94.59,137.87 | 94.69,137.87 97.13,137.87 | 76.2,49.78 78.74,49.78
  Bottom 0.203: S16.P$1 v83.21,134.01 | v71.73,76.81 71.73,64.52 75.08,61.16 75.08,50.9 76.2,49.78 J205.P$1 | v106.58,128.12 106.58,103.33 106.98,102.92 106.98,93.27 105.87,92.15 105.87,88.09 J35.P$2
28027_2_SPISTEA  (via drill 0.51)
  Top 0.203: 89.51,133.4 S19.P$2 89.61,133.4 | 87.07,133.4 S19.P$1 | 92.05,133.4 S19.P$3 92.15,133.4 | 94.59,133.4 S19.P$4 94.69,133.4 | 97.13,133.4 S19.P$5 | J207.P$1 76.2,44.7 78.74,44.7 J207.P$2 | v83.21,131.57 82.09,130.45 77.11,130.45 76.61,129.95 75.59,129.95 U11.33 | v84.84,101.5 84.84,103.33 84.12,104.04 v84.12,105.26
  Top 0.61: 87.07,133.4 89.51,133.4 | 89.61,133.4 92.05,133.4 | 92.15,133.4 94.59,133.4 | 94.69,133.4 97.13,133.4
  Bottom 0.203: v83.21,131.57 85.24,131.57 85.6,131.93 | 85.6,131.93 86.97,133.3 S19.P$1 | J207.P$2 78.74,48.16 77.62,49.28 77.62,90.73 84.84,97.94 v84.84,101.5 | v84.12,105.26 85.24,105.26 85.85,105.87 85.85,121.72 88.09,123.95 88.09,129.44 85.6,131.93
+3.3V
  Top 0.61: C30.1 55.88,162.15 54.56,163.47 | 54.56,163.47 54.46,163.58 54.46,166.32 55.88,167.74 55.88,169.47 U9.P$4 56.19,169.57 57.61,169.57 U9.P$5 | J27.P$2 44.81,164.69 48.26,164.69 49.68,163.27 54.36,163.27 54.56,163.47
+5V  (via drill 0.51)
  Top 0.61: J200.P$1 J200.P$2 17.27,159.82 18.49,158.6 18.49,151.89 17.27,150.67 17.27,150.06 J203.P$2 J203.P$1 14.43,149.66 14.43,147.83 9.86,143.26 9.86,137.67 DCDC5V.3 9.75,137.36 9.75,126.69 S18.P$2 9.55,126.39 9.55,124.26 S17.P$2 | R26.2 2.23,120.7 2.23,123.65 2.03,123.85 S17.P$5 | S17.P$5 1.93,124.16 1.93,126.39 S18.P$5 2.23,126.49 4.47,126.49 S18.P$4 | S17.P$5 2.44,123.85 4.47,123.85 S17.P$4 4.78,123.95 7.01,123.95 S17.P$3 | S18.P$3 7.01,126.39 7.01,124.26 S17.P$3 | S17.P$2 9.55,123.95 7.32,123.95 S17.P$3 | S17.P$2 9.86,123.95 12.09,123.95 S17.P$1 12.09,124.26 12.09,126.39 S18.P$1 | SV2.4 3.15,53.95 3.15,51.51 SV2.2 3.45,51.51 5.69,51.51 SV2.1 | SV2.3 5.69,53.95 5.69,51.82 SV2.1 | 62.08,74.68 62.08,76.2 C4.1 | 62.08,74.68 63.4,73.36 U12.14 63.6,73.56 64.31,74.27 69.9,74.27 IC2.24 | U7.14 63.4,88.59 62.08,89.92 62.08,92.05 C6.1 62.38,92.05 68.17,92.05 68.78,92.66 C37.1 69.09,92.76 69.09,96.42 70.41,97.74 SV23.8 | v76,73.97 76,70.51 C34.1 | v77.01,94.08 78.33,92.76 C38.1 | SV2.1 5.99,51.31 6.5,51.31 7.72,50.09 11.79,50.09 25.91,64.21 25.91,64.31 28.35,66.75 35.97,66.75 39.32,70.1 QG2.14 | v62.28,74.57 62.08,74.68 | v54.76,115.42 v54.76,145.19
  Bottom 0.61: 37.8,162.15 36.47,160.83 17.98,160.83 17.17,160.02 J200.P$2 | 37.8,162.15 46.13,170.49 58.52,170.49 61.77,173.74 75.08,173.74 77.62,171.2 78.03,171.2 J29.P$1 | v76,73.97 76,81.79 72.95,84.84 | 72.95,84.84 72.24,85.55 72.24,89.92 76.2,93.88 | 76.2,93.88 76.2,94.69 74.37,96.52 71.73,96.52 70.51,97.74 SV23.8 70.51,98.04 70.51,100.28 SV23.7 70.21,100.38 70,100.38 54.97,115.42 v54.76,115.42 | v77.01,94.08 76.4,94.08 76.2,93.88 | 72.95,84.84 62.48,74.37 | 62.48,74.37 58.12,70 58.12,69.49 55.78,67.16 47.95,67.16 45.01,70.1 39.42,70.1 QG2.14 | v62.28,74.57 62.48,74.37 | v54.76,145.19 37.8,162.15
A1
  Top 0.203: 85.9,76.96 86.97,78.03 J20.P$1 | 85.9,76.96 85.85,76.91 79.96,76.91 IC2.3 | 85.9,76.96 86.97,75.89 86.97,75.59 J20.P$2
A2
  Top 0.203: IC2.5 79.96,79.35 79.35,79.35 78.64,78.64 78.64,76.3 78.74,76.2 84.84,76.2 86.56,74.47 88.49,74.47 89.51,75.49 J19.P$2 89.51,75.59 89.51,78.03 J19.P$1
A3  (via drill 0.51)
  Top 0.203: v83.31,82.09 83.21,81.99 79.96,81.99 IC2.7 | J18.P$2 92.05,75.59 92.05,78.03 J18.P$1
  Bottom 0.203: v83.31,82.09 88.09,82.09 J18.P$1
A4
  Top 0.203: IC2.9 79.96,84.43 79.35,84.43 77.83,82.91 77.83,74.57 78.74,73.66 92.76,73.66 94.59,75.49 J17.P$2 94.59,75.59 94.59,78.03 J17.P$1
A5
  Top 0.203: 97.13,78.03 J16.P$1 | IC2.11 79.96,87.07 84.33,87.07 86.56,89.31 96.42,89.31 98.25,87.48 98.25,79.15 97.23,78.13 J16.P$1 | J16.P$2 97.13,75.59 97.13,77.93 J16.P$1
A4973EN  (via drill 0.51)
  Top 0.203: v24.59,55.47 23.37,56.69 23.37,57.2 U1.8 | U5.8 39.83,57.2 v38.81,56.19 37.59,56.19 36.88,55.47 36.88,53.65 35.97,52.73 35.97,32.61 44.2,24.38 S1.P$2
  Bottom 0.203: v24.59,55.47 24.99,55.47 25.7,56.19 v38.81,56.19
ADCA0  (via drill 0.51)
  Top 0.203: v126.19,94.28 125.98,94.49 122.94,94.49 U8.21
  Bottom 0.203: v126.19,94.28 133.4,101.5 133.4,104.85 133.81,105.26 133.81,115.42 131.47,117.75 119.69,117.75 118.16,116.23 SV15.7
ADCA0_2
  Top 0.203: U11.21 75.49,122.02 74.57,122.02 73.46,120.9 73.46,117.14 77.22,113.39 80.16,113.39 86.77,106.78 S23.P$1
  Top 0.61: S23.P$1 S23.P$2 S23.P$3 S23.P$4 S23.P$5
  Bottom 0.203: SV12.4 102.92,130.15 102.92,129.13 99.06,125.27 99.06,115.93 96.01,112.88 96.01,107.8 97.13,106.68 S23.P$5
ADCA2  (via drill 0.51)
  Top 0.203: v124.46,93.67 124.36,93.78 122.94,93.78 U8.20 | v134.21,103.43 v132.59,101.8
  Bottom 0.203: v132.59,101.8 v124.46,93.67 | v134.21,103.43 134.21,115.62 131.67,118.16 117.55,118.16 115.62,116.23 SV15.9
ADCA2_2  (via drill 0.51)
  Top 0.203: 87.07,102.31 S28.P$1 | 89.51,102.31 S28.P$2 89.61,102.31 | 92.05,102.31 S28.P$3 92.15,102.31 | 94.59,102.31 S28.P$4 94.79,102.31 97.13,102.31 S28.P$5 97.23,102.51 101.7,106.98 101.7,111.56 v107.8,117.65 | v74.27,120.6 75.08,121.41 75.49,121.41 U11.20
  Top 0.61: 89.51,102.31 87.07,102.31 | 89.61,102.31 92.05,102.31 | 92.15,102.31 94.59,102.31 | S28.P$4 S28.P$5
  Bottom 0.203: v74.27,120.6 72.75,120.6 72.54,120.8 71.93,120.8 71.42,120.29 71.42,116.84 73.46,114.81 73.46,113.79 72.85,113.18 69.8,113.18 69.19,113.79 68.58,113.79 68.07,113.28 68.07,112.67 78.44,102.31 86.97,102.31 S28.P$1 | v107.8,117.65 107.8,128.93 141.83,162.97 141.83,163.88 SV11.3
ADCA4
  Top 0.203: U8.19 114.61,93.88 109.22,93.88 104.95,98.15 104.95,112.27 107.8,115.11 109.42,115.11 110.44,116.13 SV15.13
ADCA4_2  (via drill 0.51)
  Top 0.203: 40.64,102.92 S12.P$1 | 43.18,102.92 S12.P$2 | 48.26,102.92 S12.P$4 | 45.72,102.92 S12.P$3 | 68.53,113.33 63.91,108.71 56.59,108.71 50.8,102.92 S12.P$5 | 68.53,113.33 68.78,113.59 68.78,115.01 67.36,116.43 67.36,121.41 U11.19 | 68.53,113.33 v68.89,112.98
  Top 0.61: 40.64,102.92 43.18,102.92 45.72,102.92 48.26,102.92
  Bottom 0.203: 48.26,102.92 S12.P$4 | 50.8,102.92 S12.P$5 | v68.89,112.98 77.42,104.44 96.52,104.44 98.25,106.17 98.25,107.49 105.16,114.4 105.16,128.83 141.83,165.51 141.83,166.42 SV11.4
  Bottom 0.61: 50.8,102.92 48.26,102.92
ADCA6  (via drill 0.51)
  Top 0.203: v110.13,96.01 111.56,94.59 114.61,94.59 U8.18
  Bottom 0.203: v110.13,96.01 110.64,96.01 112.27,97.64 113.39,97.64 125.68,109.93 125.68,113.59 SV15.2
ADCA6_2  (via drill 0.51)
  Top 0.203: 40.64,107.39 S11.P$1 | 43.18,107.39 S11.P$2 | 45.72,107.39 S11.P$3 | 129.06,195.16 J71.P$2 128.83,194.97 104.55,194.97 99.57,189.99 99.57,174.24 v80.06,154.74 | 131.5,195.16 J71.P$1 | 48.26,107.39 S11.P$4 | 50.8,107.39 S11.P$5 51,107.59 52.53,109.12 55.58,109.12 | 130.45,195.16 130.45,189.59 131.57,188.47 131.57,185.12 R13.2 | 55.58,109.12 63.7,109.12 68.38,113.79 68.38,114.81 66.14,117.04 66.14,121.82 66.34,122.02 67.26,122.02 U11.18 | v59.23,140.11 59.23,139.6 55.58,135.94 55.58,109.12
  Top 0.61: 40.64,107.39 43.18,107.39 45.72,107.39 48.26,107.39 50.8,107.39 | 131.5,195.16 130.45,195.16 129.06,195.16
  Bottom 0.203: v80.06,154.74 77.32,154.74 62.69,140.11 v59.23,140.11
ADCB2
  Top 0.203: U8.24 122.83,96.52 121.92,96.52 121.61,96.83 121.61,105.77 121.92,106.07 122.02,106.07 122.22,106.27 122.22,108.41 118.06,112.57 115.11,112.57 114.1,113.59 114.1,115.11 113.08,116.13 SV15.11
ADCB2_2
  Top 0.203: 89.51,111.15 S27.P$2 89.61,111.15 | 87.07,111.15 S27.P$1 86.87,111.35 86.87,113.79 76.61,124.05 75.59,124.05 U11.24 | 92.05,111.15 S27.P$3 92.15,111.15 | 94.59,111.15 S27.P$4 94.69,111.15 | 97.13,111.15 S27.P$5 | J73.P$1 131.57,189.99 136.25,189.99 141.12,185.12 141.73,185.12 R12.2 141.83,185.01 141.83,169.06 SV11.5
  Top 0.61: 87.07,111.15 89.51,111.15 | 89.61,111.15 92.05,111.15 | 92.15,111.15 94.59,111.15 | 94.69,111.15 97.13,111.15
  Bottom 0.203: J73.P$2 129.03,190.09 131.57,190.09 J73.P$1 | S27.P$5 97.23,111.15 97.23,113.49 104.75,121.01 104.75,131.88 141.83,168.96 SV11.5
ADCB4  (via drill 0.51)
  Top 0.203: v124.46,97.64 123.95,97.13 122.94,97.13 U8.25 | v124.16,115.11 115.11,115.11 114.1,116.13 114.1,116.74 113.49,117.35 109.12,117.35 108,116.23 SV15.15
  Bottom 0.203: v124.46,97.64 129.95,103.12 129.95,106.78 130.96,107.8 130.96,112.37 132.99,114.4 132.99,115.01 132.49,115.52 127,115.52 126.59,115.11 v124.16,115.11
ADCB4_2  (via drill 0.51)
  Top 0.203: 89.51,115.62 S25.P$2 89.61,115.62 | 87.07,115.62 S25.P$1 86.87,115.82 78.03,124.66 75.59,124.66 U11.25 | 92.05,115.62 S25.P$3 92.15,115.62 | 94.59,115.62 S25.P$4 94.69,115.62 | 97.13,115.62 S25.P$5 | v120.09,153.42 120.09,163.78 122.63,166.32 123.95,166.32 IC3.5
  Top 0.61: 87.07,115.62 89.51,115.62 | 89.61,115.62 92.05,115.62 | 92.15,115.62 94.59,115.62 | 97.13,115.62 94.69,115.62
  Bottom 0.203: 110.19,143.51 96.01,129.34 96.01,116.74 97.13,115.62 S25.P$5 | 110.19,143.51 v120.09,153.42 | 110.19,143.51 79.55,174.14 79.55,174.75 78.54,175.77 77.93,175.77 74.17,179.53 70.41,179.53 69.39,180.54 69.39,181.05 68.38,182.07 45.11,182.07 34.95,192.23 33.93,192.23 SV13.5
ADCB6_2  (via drill 0.51)
  Top 0.203: 89.51,120.09 S22.P$2 89.61,120.09 | 87.07,120.09 S22.P$1 86.87,120.29 81.89,125.27 75.59,125.27 U11.26 | 92.05,120.09 S22.P$3 92.15,120.09 | 94.59,120.09 S22.P$4 94.69,120.09 | 97.13,120.09 S22.P$5 | IC3.9 118.67,167.64 v119.89,166.42
  Top 0.61: 87.07,120.09 89.51,120.09 | 89.61,120.09 92.05,120.09 | 92.15,120.09 94.59,120.09 | 94.69,120.09 97.13,120.09
  Bottom 0.203: v119.89,166.42 122.63,163.68 122.63,153.92 98.65,129.95 98.65,121.51 S22.P$5
B1
  Top 0.203: 86.97,84.53 J15.P$2 | IC2.2 79.96,75.59 78.74,75.59 78.23,76.1 78.23,80.77 78.74,81.28 83.62,81.28 86.87,84.53 J15.P$2 | J15.P$1 86.97,86.97 86.97,84.63 J15.P$2
B2
  Top 0.203: 89.51,84.53 J14.P$2 | IC2.4 79.96,78.13 83.01,78.13 89.41,84.53 J14.P$2 | J14.P$1 89.51,86.97 89.51,84.63 J14.P$2
B3
  Top 0.203: 92.05,84.53 J11.P$2 92.05,84.63 92.05,86.97 J11.P$1 92.05,87.07 91.03,88.09 89.1,88.09 88.39,87.38 88.39,84.33 84.73,80.67 79.96,80.67 IC2.6
B4
  Top 0.203: IC2.8 79.96,83.21 81.69,83.21 86.97,88.49 93.17,88.49 94.59,87.07 J10.P$1 94.59,86.97 94.59,84.53 J10.P$2
B5
  Top 0.203: IC2.10 79.96,85.75 83.62,85.75 86.77,88.9 95.3,88.9 97.13,87.07 J9.P$1 97.13,86.97 97.13,84.53 J9.P$2
DRV1_DIR  (via drill 0.51)
  Top 0.203: J80.P$1 86.87,30.68 89.31,30.68 J80.P$2 | v91.54,11.68 94.28,8.94 95.61,8.94 95.91,9.25 95.91,10.57 U2.P$2
  Bottom 0.203: v91.54,11.68 91.54,28.45 89.41,30.58 J80.P$2
DRV1_M+
  Top 0.356: U2.P$8 99.91,9.31 100.33,9.53
  Top 0.762: 100.33,9.53 100.33,9.68
  Top 1.016: 100.33,9.68 109.38,9.68 SV7.1 SV7.3 SV7.5
DRV1_M-
  Top 0.356: U2.P$10 99.26,19.25 99.54,19.53
  Top 1.016: 99.54,19.53 102.55,19.37 105.41,16.51 SV7.6 SV7.4 SV7.2
DRV1_PWM  (via drill 0.51)
  Top 0.203: J79.P$1 86.87,33.22 89.31,33.22 J79.P$2 | v94.49,9.86 94.59,9.86 95.3,10.57 U2.P$1
  Bottom 0.203: v94.49,9.86 94.49,6.1 94.69,5.89 94.69,5.28 94.18,4.78 93.57,4.78 91.85,6.5 91.34,6.5 90.63,7.21 90.63,12.6 91.03,13.01 91.03,27.43 88.29,30.18 88.29,32.11 89.31,33.12 J79.P$2
DRV2_DIR  (via drill 0.51)
  Top 0.203: J83.P$2 65.84,30.68 63.4,30.68 J83.P$1 | v59.94,9.86 60.86,8.94 63.6,8.94 63.91,9.25 63.91,10.57 U4.P$2
  Bottom 0.203: v59.94,9.86 56.29,9.86 53.44,12.7 53.44,24.28 59.64,30.48 59.64,30.99 60.76,32.11 61.27,32.11 62.18,33.02 62.18,33.53 62.99,34.34 63.7,34.34 64.41,33.63 64.41,31.7 63.4,30.68 J83.P$1
DRV2_M+
  Top 0.356: U4.P$8 67.84,9.47 68.26,9.37
  Top 1.016: 68.26,9.37 77.47,9.37 77.47,11.27 SV8.1 SV8.3 SV8.5
DRV2_M-
  Top 0.356: U4.P$10 67.19,19.09 67.63,19.53
  Top 1.016: 67.63,19.53 71.75,19.53 SV8.6 SV8.4 SV8.2
DRV2_PWM  (via drill 0.51)
  Top 0.203: J82.P$2 65.84,33.22 63.4,33.22 J82.P$1 | v56.59,10.67 63.2,10.67 U4.P$1
  Bottom 0.203: v56.59,10.67 55.27,11.99 55.27,15.85 57.71,18.29 58.22,18.29 62.18,22.25 62.18,32 63.3,33.12 J82.P$1
DTR
  Top 0.203: 98.42,177.22 SV17.3 | SV17.4 95.91,177.19 95.91,177.22
  Top 0.61: 98.42,177.22 95.91,177.22 95.89,177.22
  Bottom 0.203: J30.P$1 70.51,183.49 89.51,183.49 95.81,177.19 SV17.4
GND  (via drill 0.51)
  Top 0.203: 98.42,189.92 SV17.13 | 78.16,174.68 SV6.17 | 80.59,174.68 SV6.18
  Top 0.356: U2.P$16 95.36,13.97 U2.P$17 | U2.P$15 96.01,13.97 U2.P$17 | U2.P$9 99.91,13.97 U2.P$17 | U2.P$7 99.26,13.97 U2.P$17 | U4.P$16 63.29,14.18 63.5,13.97 | U4.P$15 63.94,14.17 64.14,13.97 | U4.P$9 67.84,14.08 67.94,13.97 | U4.P$7 67.19,13.93 67.15,13.97 | U8.23 121.41,95.8 121.1,95.8 121.1,98.39 | 121.1,98.39 121.1,104.25 | 121.1,104.25 121.1,104.89 | 121.1,104.89 C11.2 | U8.12 121.1,98.39 | 121.1,104.89 U8.2 110.5,104.89 C18.2 | U8.3 121.1,104.25 | 73.78,132.52 U11.2 64.7,132.52 C33.2 | 73.78,132.52 C32.2 | U11.23 73.78,123.42 73.78,126.02 | 73.78,126.02 73.78,131.87 | 73.78,131.87 73.78,132.52 | U11.3 73.78,131.87 | U11.12 68.89,126.02 73.78,126.02
  Top 0.61: J70.P$2 139.22,195.16 141.66,195.16 J70.P$1 141.63,194.87 141.63,190.4 J72.P$1 141.66,190.08 139.22,190.08 J72.P$2 | J7.P$1 108.81,172.11 108.81,174.55 J7.P$2 | 134.62,92.66 C7.2 | 63.3,124.05 C29.2 63.6,124.05 64.82,124.05 v65.02,123.85 | v68.89,125.88 68.89,126.02 | U$1.2 88.9,62.48 86.56,62.48 J124.P$3 86.36,62.48 84.02,62.48 J124.P$2 83.82,62.48 81.48,62.48 J124.P$1 81.08,62.59 73.25,70.41 C34.2 | TRIMPOT2.5 57.4,2.74 59.84,2.74 TRIMPOT2.6 | C25.- 56.9,14.12 C28.- 55.07,13.51 48.46,13.51 46.74,11.79 S1.P$1 | 71.02,21.54 C22.2 71.32,21.54 78.23,21.54 84.84,14.94 v86.36,13.97 | v103.63,20.02 103.02,20.62 103.02,21.54 C16.2 103.23,21.74 108.61,27.13 136.25,27.13 139.5,30.38 141.33,30.38 S20.P$1 141.63,30.48 141.63,33.02 S20.P$2 141.63,33.22 141.63,35.56 S20.P$3 141.63,35.76 141.63,38.1 S20.P$4 141.63,38.3 141.63,40.64 S20.P$5 141.63,40.84 141.63,43.18 S20.P$6 141.63,43.38 141.63,45.72 S20.P$7 141.63,45.92 141.63,48.26 S20.P$8 141.63,48.46 141.63,50.8 S20.P$9 141.63,51 141.63,53.34 S20.P$10 141.63,53.54 141.63,55.88 S24.P$1 141.63,56.08 141.63,58.42 S24.P$2 141.63,58.62 141.63,60.96 S24.P$3 141.63,61.16 141.63,63.5 S24.P$4 141.63,63.7 141.63,66.04 S24.P$5 141.63,66.24 141.63,68.58 S24.P$6 141.63,68.78 141.63,71.12 S24.P$7 141.63,71.32 141.63,73.66 S24.P$8 141.63,73.86 141.63,76.2 S24.P$9 141.63,76.4 141.63,78.74 S24.P$10 141.33,78.84 140.72,78.84 135.64,83.92 | 75.59,3.56 R43.2 75.89,3.45 85.85,3.45 | 84.94,12.9 v86.36,13.97 | v102.72,8.43 107.59,3.56 R41.2 | 89,2.74 TRIMPOT1.5 | U5.5 43.69,57.3 44.91,57.3 U5.4 | R7.1 43.59,62.79 43.59,60.35 C2.2 43.79,60.15 43.79,57.61 U5.5